# EAGLE schematic UDAWA_Gadadar (EAGLE 9.7.0)
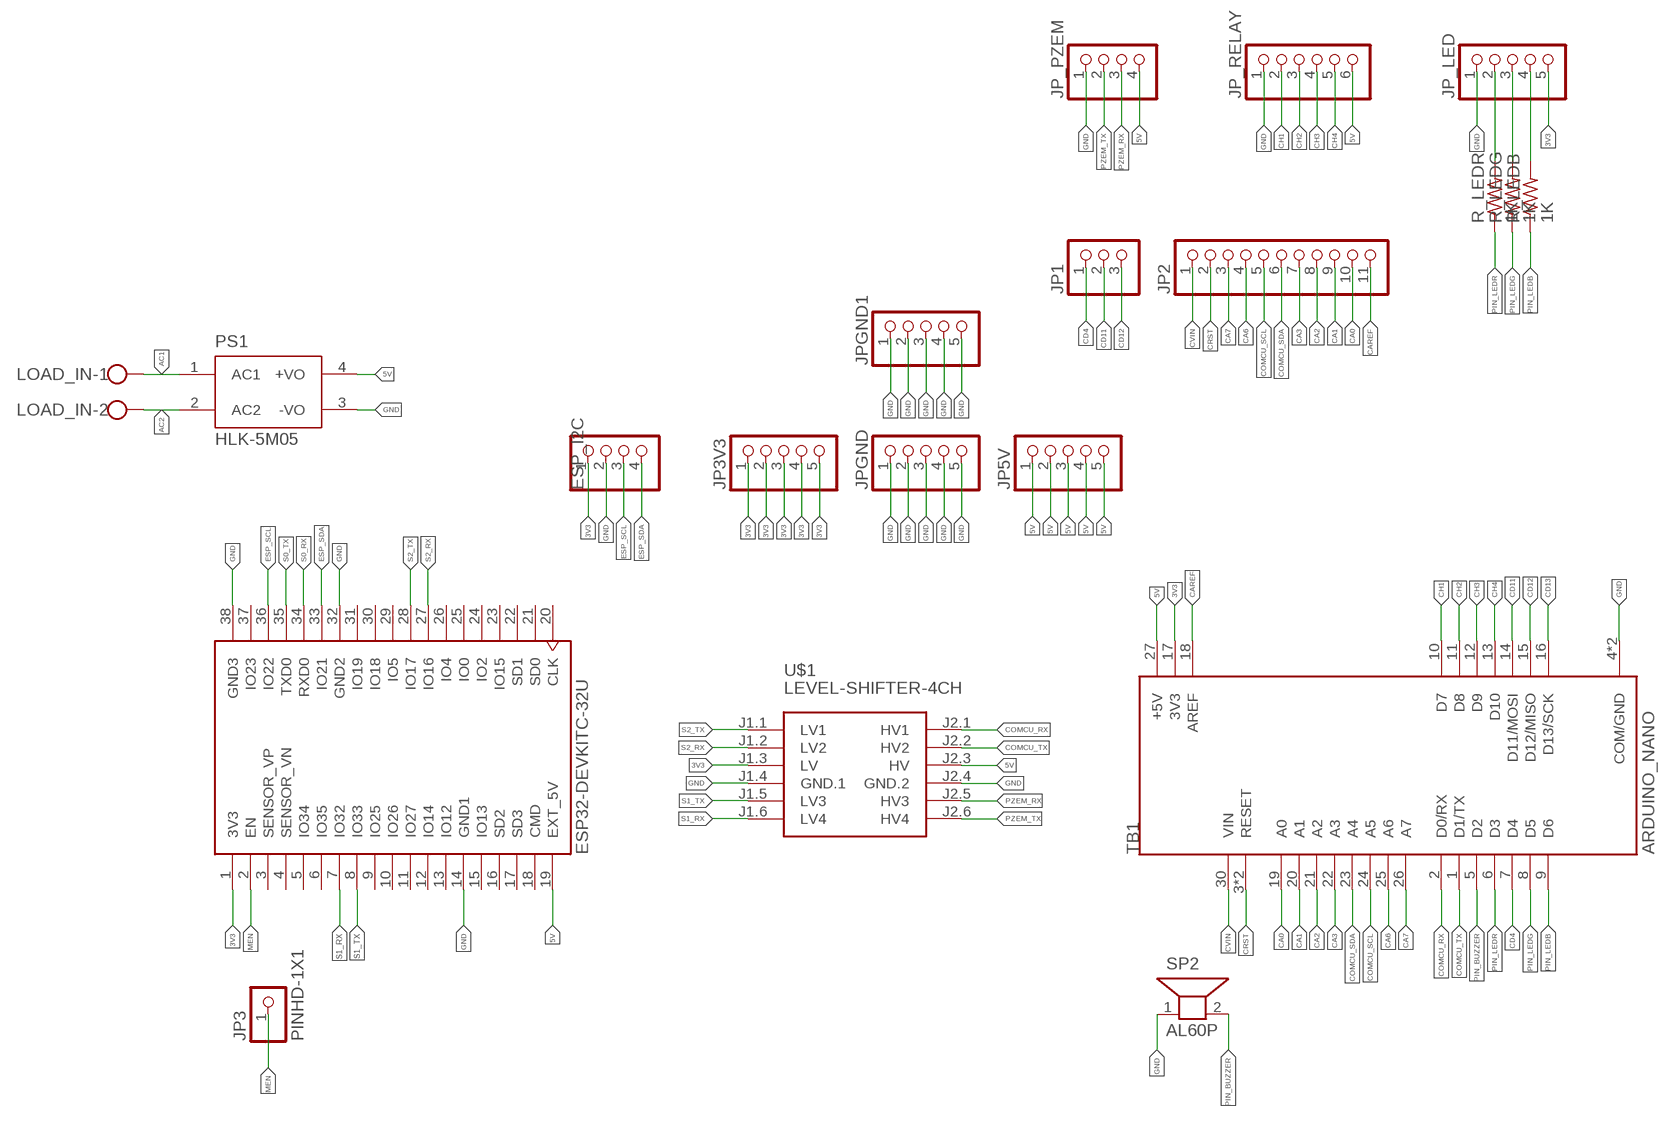
[diagram p0: schematic, sheet 1]

## Parts
ESP_I2C  PINHD-1X4  [1X04]
JP1  PINHD-1X3  [1X03]
JP2  PINHD-1X11  [1X11]
JP3  PINHD-1X1  [1X01]
JP3V3  PINHD-1X5  [1X05]
JP5V  PINHD-1X5  [1X05]
JP_LED  PINHD-1X5  [1X05]
JP_PZEM  PINHD-1X4  [1X04]
JP_RELAY  PINHD-1X6  [1X06]
JPGND  PINHD-1X5  [1X05]
JPGND1  PINHD-1X5  [1X05]
LOAD_IN  W237-102  [W237-102]
PS1  HLK-5M05  [CONV_HLK-5M05]
R_LEDB  1K  R-US_0204/5  [0204/5]
R_LEDG  1K  R-US_0204/5  [0204/5]
R_LEDR  1K  R-US_0204/5  [0204/5]
SP2  AL60P  [AL60P]
TB1  ARDUINO_NANO  [SHIELD_ARDUINO_NANO]
U2  ESP32-DEVKITC-32U  [MODULE_ESP32-DEVKITC-32U]
U$1  LEVEL-SHIFTER-4CH  [LEVEL-SHIFTER-4CH]

## Nets
3V3: ESP_I2C.1 JP3V3.1 JP3V3.2 JP3V3.3 JP3V3.4 JP3V3.5 JP_LED.5 TB1.17(3V3) U2.1(3V3) U$1.J1.3(LV)
5V: JP5V.1 JP5V.2 JP5V.3 JP5V.4 JP5V.5 JP_PZEM.4 JP_RELAY.6 PS1.4(+VO) TB1.27(+5V) U2.19(EXT_5V) U$1.J2.3(HV)
AC1: LOAD_IN.1 PS1.1(AC1)
AC2: LOAD_IN.2 PS1.2(AC2)
CA0: JP2.10 TB1.19(A0)
CA1: JP2.9 TB1.20(A1)
CA2: JP2.8 TB1.21(A2)
CA3: JP2.7 TB1.22(A3)
CA6: JP2.4 TB1.25(A6)
CA7: JP2.3 TB1.26(A7)
CAREF: JP2.11 TB1.18(AREF)
CD4: JP1.1 TB1.7(D4)
CD11: JP1.2 TB1.14(D11/MOSI)
CD12: JP1.3 TB1.15(D12/MISO)
CD13: TB1.16(D13/SCK)
CH1: JP_RELAY.2 TB1.10(D7)
CH2: JP_RELAY.3 TB1.11(D8)
CH3: JP_RELAY.4 TB1.12(D9)
CH4: JP_RELAY.5 TB1.13(D10)
COMCU_RX: TB1.2(D0/RX) U$1.J2.1(HV1)
COMCU_SCL: JP2.5 TB1.24(A5)
COMCU_SDA: JP2.6 TB1.23(A4)
COMCU_TX: TB1.1(D1/TX) U$1.J2.2(HV2)
CRST: JP2.2 TB1.3(RESET) TB1.28(RESET)
CVIN: JP2.1 TB1.30(VIN)
ESP_SCL: ESP_I2C.3 U2.36(IO22)
ESP_SDA: ESP_I2C.4 U2.33(IO21)
GND: ESP_I2C.2 JP_LED.1 JP_PZEM.1 JP_RELAY.1 JPGND1.1 JPGND1.2 JPGND1.3 JPGND1.4 JPGND1.5 JPGND.1 JPGND.2 JPGND.3 JPGND.4 JPGND.5 PS1.3(-VO) SP2.1 TB1.4(COM/GND) TB1.29(COM/GND) U2.14(GND1) U2.32(GND2) U2.38(GND3) U$1.J1.4(GND.1) U$1.J2.4(GND.2)
MEN: JP3.1 U2.2(EN)
PIN_BUZZER: SP2.2 TB1.5(D2)
PIN_LEDB: R_LEDB.1 TB1.9(D6)
PIN_LEDG: R_LEDG.1 TB1.8(D5)
PIN_LEDR: R_LEDR.1 TB1.6(D3)
PZEM_RX: JP_PZEM.3 U$1.J2.5(HV3)
PZEM_TX: JP_PZEM.2 U$1.J2.6(HV4)
RLEDB: JP_LED.4 R_LEDB.2
RLEDG: JP_LED.3 R_LEDG.2
RLEDR: JP_LED.2 R_LEDR.2
S0_RX: U2.34(RXD0)
S0_TX: U2.35(TXD0)
S1_RX: U2.7(IO32) U$1.J1.6(LV4)
S1_TX: U2.8(IO33) U$1.J1.5(LV3)
S2_RX: U2.27(IO16) U$1.J1.2(LV2)
S2_TX: U2.28(IO17) U$1.J1.1(LV1)
Unconnected: U2.3(SENSOR_VP) U2.4(SENSOR_VN) U2.5(IO34) U2.6(IO35) U2.9(IO25) U2.10(IO26) U2.11(IO27) U2.12(IO14) U2.13(IO12) U2.15(IO13) U2.16(SD2) U2.17(SD3) U2.18(CMD) U2.20(CLK) U2.21(SD0) U2.22(SD1) U2.23(IO15) U2.24(IO2) U2.25(IO0) U2.26(IO4) U2.29(IO5) U2.30(IO18) U2.31(IO19) U2.37(IO23)

## Library data of the parts
ESP_I2C JP_PZEM = pinhead:PINHD-1X4: PIN HEADER
JP1 = pinhead:PINHD-1X3: PIN HEADER
JP2 = pinhead:PINHD-1X11: PIN HEADER
JP3 = Connector:PINHD-1X1: PIN HEADER; CATEGORY: CONNECTOR; SUB-CATEGORY: PIN-HEADER
JP3V3 JP5V JP_LED JPGND JPGND1 = pinhead:PINHD-1X5: PIN HEADER
JP_RELAY = pinhead:PINHD-1X6: PIN HEADER
LOAD_IN = con-wago-500:W237-102: WAGO SCREW CLAMP; MPN: 237-102; OC_FARNELL: unknown; OC_NEWARK: 70K9898
PS1 = HLK-5M05:HLK-5M05: AC DC 220V to 5V 5W 5Watt Isolated Switching Step-Down Power Supply Module Converter Check availability <https://pricing.snapeda.com/parts/HLK-5M05/Hi-link/view-part?ref=eda>; AVAILABILITY: Not in stock; MF: Hi-link; MP: HLK-5M05; PACKAGE: Package; PRICE: None
R_LEDB R_LEDG R_LEDR = rcl:R-US_: RESISTOR, American symbol; SPICEPREFIX: R
SP2 = buzzer:AL60P: SPEAKER Source: Buerklin; OC_FARNELL: unknown; OC_NEWARK: unknown
TB1 = ARDUINO_NANO:ARDUINO_NANO: Arduino Nano, Through Hole Check availability <https://pricing.snapeda.com/parts/Arduino%20Nano/Arduino/view-part?ref=eda>; AVAILABILITY: Not in stock; DESCRIPTION: Small, complete, and breadboard-friendly board based on the ATmega328 (Arduino Nano 3.x); MF: Arduino; MP: Arduino Nano; PACKAGE: Non-Standard Arduino; PRICE: None
U2 = ESP32-DEVKITC-32U:ESP32-DEVKITC-32U: ESP32-DEVKITC Check availability <https://pricing.snapeda.com/parts/ESP32-DEVKITC-32U/Espressif%20Systems/view-part?ref=eda>; AVAILABILITY: In Stock; DESCRIPTION: ESP32-WROOM-32UE series Transceiver; 802.11 b/g/n (Wi-Fi, WiFi, WLAN), Bluetooth® Smart Ready 4.x Dual Mode Evaluation Board; MF: Espressif Systems; MP: ESP32-DEVKITC-32U; PACKAGE: None; PRICE: None; PURCHASE-URL: https://pricing.snapeda.com/search/part/ESP32-DEVKITC-32U/?ref=eda
U$1 = diy-modules:LEVEL-SHIFTER-4CH: 4-Channel Bi-Directional Logic Level Converter based on BSS128 transistors Click here to find device on ebay.com <http://www.ebay.com/sch/i2c+logic+converter+module>